# EAGLE design test-shield (EAGLE 8.3.0)
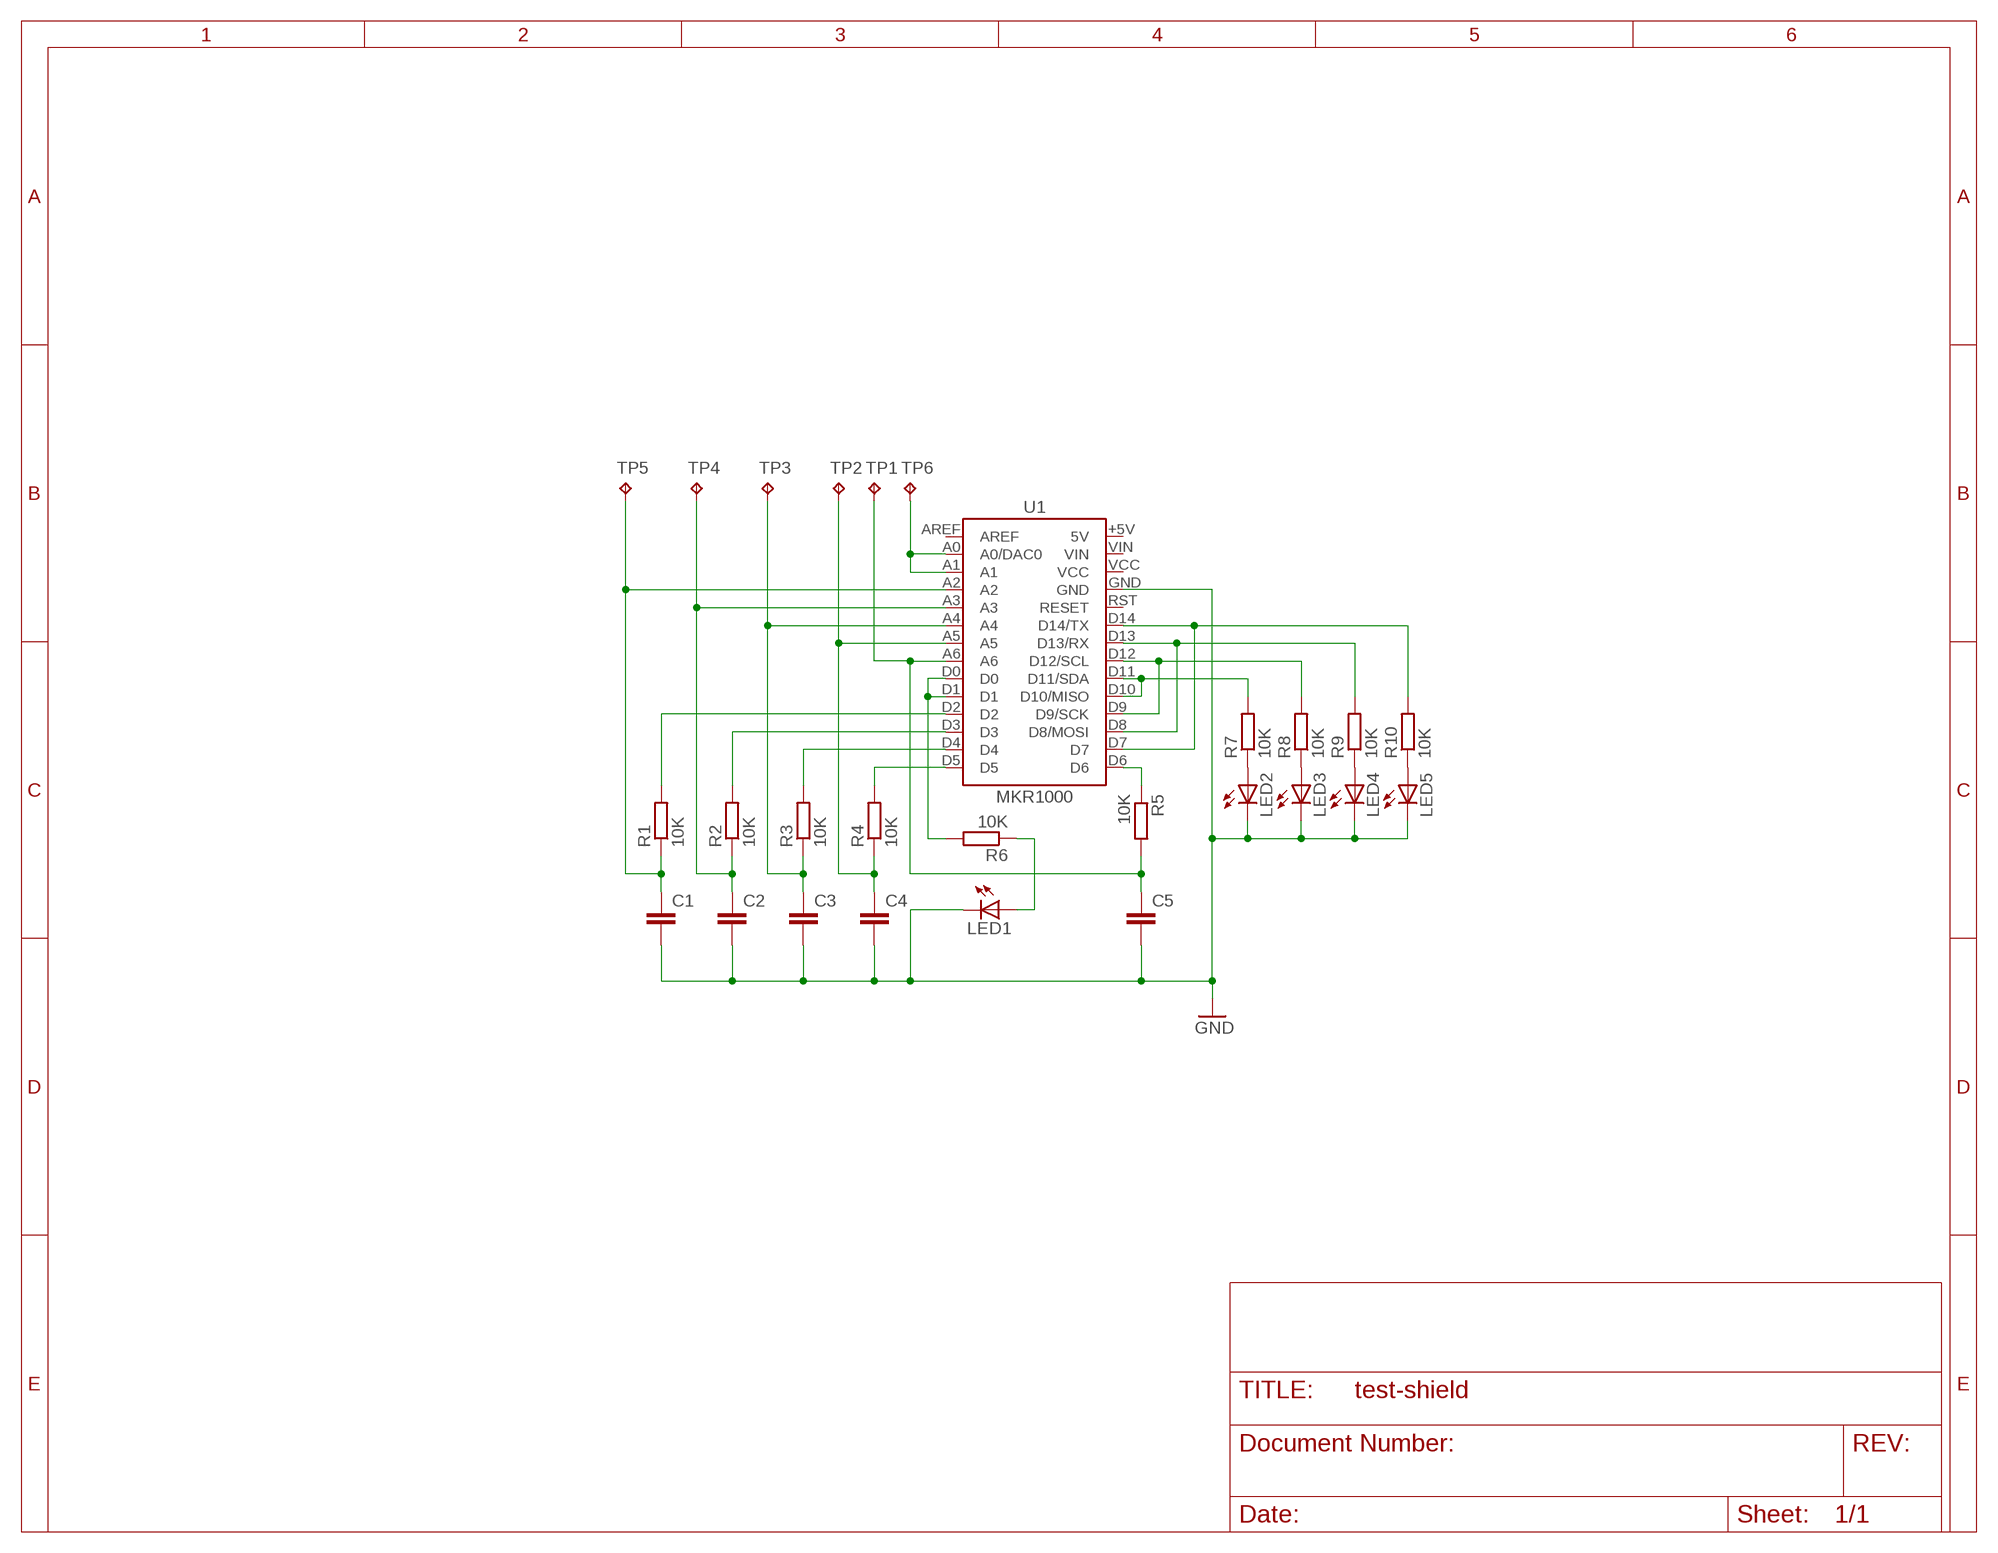
[diagram p0: schematic, sheet 1]

## Parts
C1  C-EUC0603  [C0603]
C2  C-EUC0603  [C0603]
C3  C-EUC0603  [C0603]
C4  C-EUC0603  [C0603]
C5  C-EUC0603  [C0603]
LED1  LEDCHIPLED_0805  [CHIPLED_0805]
LED2  LEDCHIPLED_0805  [CHIPLED_0805]
LED3  LEDCHIPLED_0805  [CHIPLED_0805]
LED4  LEDCHIPLED_0805  [CHIPLED_0805]
LED5  LEDCHIPLED_0805  [CHIPLED_0805]
R1  10K  R-EU_R0603  [R0603]
R2  10K  R-EU_R0603  [R0603]
R3  10K  R-EU_R0603  [R0603]
R4  10K  R-EU_R0603  [R0603]
R5  10K  R-EU_R0603  [R0603]
R6  10K  R-EU_R0603  [R0603]
R7  10K  R-EU_R0603  [R0603]
R8  10K  R-EU_R0603  [R0603]
R9  10K  R-EU_R0603  [R0603]
R10  10K  R-EU_R0603  [R0603]
TP1  TPPAD1-13  [P1-13]
TP2  TPPAD1-13  [P1-13]
TP3  TPPAD1-13  [P1-13]
TP4  TPPAD1-13  [P1-13]
TP5  TPPAD1-13  [P1-13]
TP6  TPPAD1-13  [P1-13]
U1  MKR1000  [MKR1000-THRU-HOLE]

## Nets
GND: C1.2 C2.2 C3.2 C4.2 C5.2 LED1.C LED2.C LED3.C LED4.C LED5.C U1.GND
N$1: R1.2 U1.D2
N$2: R2.2 U1.D3
N$3: R3.2 U1.D4
N$4: R4.2 U1.D5
N$6: R5.1 U1.D6
N$7: C1.1 R1.1 TP5.TP U1.A2
N$8: C2.1 R2.1 TP4.TP U1.A3
N$9: C3.1 R3.1 TP3.TP U1.A4
N$10: C4.1 R4.1 TP2.TP U1.A5
N$11: R10.2 U1.D7 U1.D14(D14/TX)
N$12: C5.1 R5.2 TP1.TP U1.A6
N$13: TP6.TP U1.A0(A0/DAC0) U1.A1
N$14: R6.2 U1.D0 U1.D1
N$15: R9.2 U1.D8(D8/MOSI) U1.D13(D13/RX)
N$16: R8.2 U1.D9(D9/SCK) U1.D12(D12/SCL)
N$17: R7.2 U1.D10(D10/MISO) U1.D11(D11/SDA)
N$18: LED2.A R7.1
N$19: LED3.A R8.1
N$20: LED4.A R9.1
N$21: LED5.A R10.1
N$22: LED1.A R6.1
Unconnected: U1.+5V(5V) U1.AREF U1.RST(RESET) U1.VCC U1.VIN

## Library data of the parts
C1-C5 = resistor:C-EU: CAPACITOR, European symbol
LED1-LED5 = adafruit:LED: LED OSRAM: - CHIPLED LG R971, LG N971, LY N971, LG Q971, LY Q971, LO R971, LY R971 LH N974, LH R974 LS Q976, LO Q976, LY Q976 LO Q996 - Hyper CHIPLED LW Q18S LB Q993, LB Q99A, LB R99A - SideLED LS A670, LO A670, LY A670, LG A670, LP A670 LB A673, LV A673, LT A673, LW A673 LH A674 LY A675 LS A676, LA A676, LO A676, LY A676, LW A676 LS A679, LY A679, LG A679 - Hyper Micro SIDELED® LS Y876, LA Y876, LO Y876, LY Y876 LT Y87S - SmartLED LW L88C, LW L88S LB L89C, LB L89S, LG L890 LS L89K, LO L89K, LY L89K LS L896, LA L896, LO L896, LY L896 - TOPLED LS T670, LO T670, LY T670, LG T670, LP T670 LSG T670, LSP T670, LSY T670, LOP T670, LYG T670 LG T671, LOG T671, LSG T671 LB T673, LV T673, LT T673, LW T673 LH T674 LS T676, LA T676, LO T676, LY T676, LB T676, LH T676, LSB T676, LW T676 LB T67C, LV T67C, LT T67C, LS T67K, LO T67K, LY T67K, LW E67C LS E67B, LA E67B, LO E67B, LY E67B, LB E67C, LV E67C, LT E67C LW T67C LS T679, LY T679, LG T679 LS T770, LO T770, LY T770, LG T770, LP T770 LB T773, LV T773, LT T773, LW T773 LH T774 LS E675, LA E675, LY E675, LS T675 LS T776, LA T776, LO T776, LY T776, LB T776 LHGB T686 LT T68C, LB T68C - Hyper Mini TOPLED® LB M676 - Mini TOPLED Santana® LG M470 LS M47K, LO M47K, LY M47K Source: http://www.osram.convergy.de/
R1-R10 = resistor:R-EU_: RESISTOR, European symbol
TP1-TP6 = testpad:TP: Test pad
U1 = arduino-shields:MKR

## Board
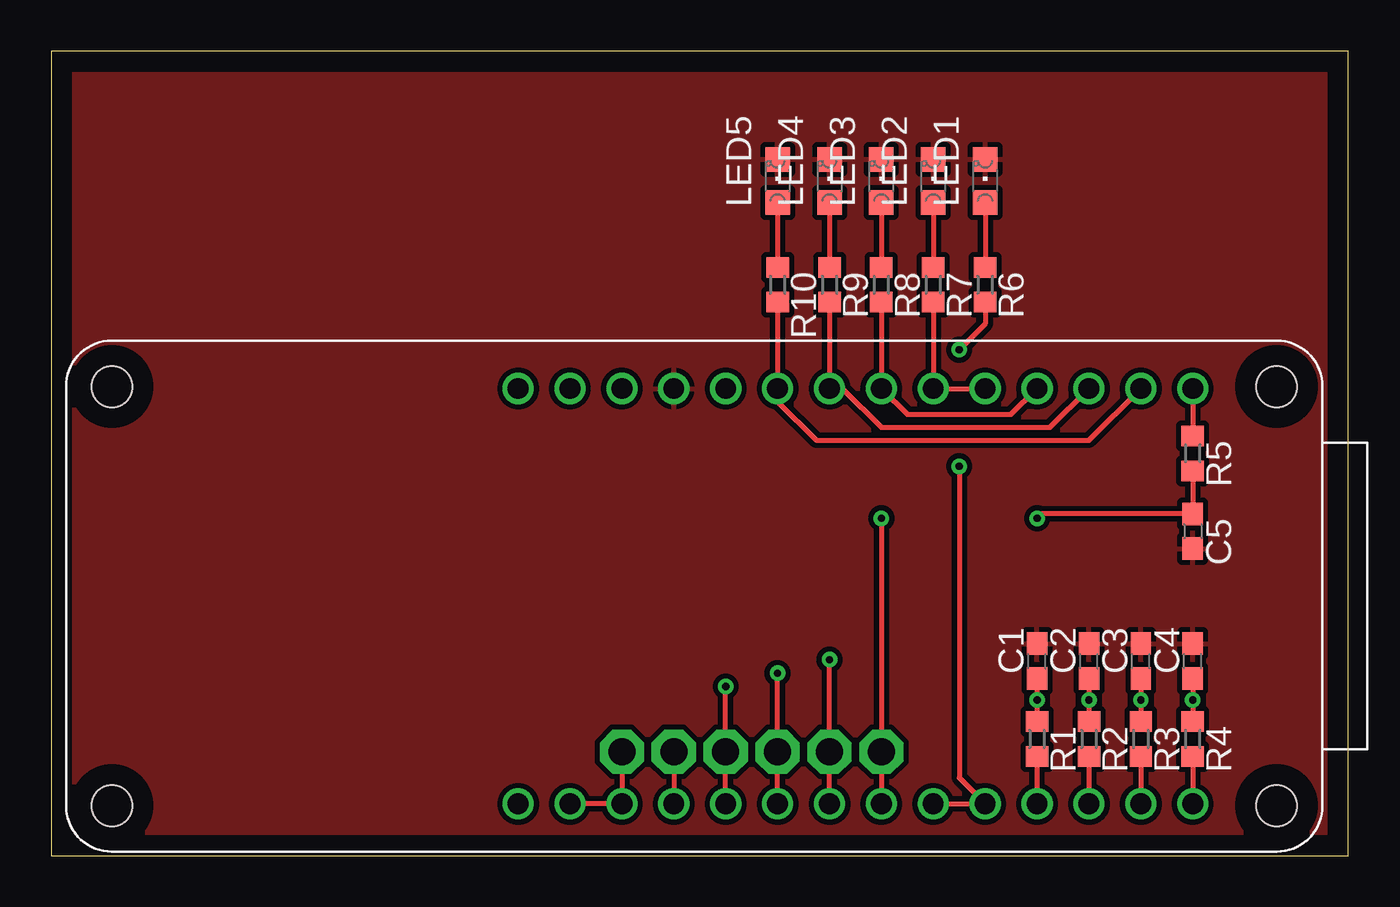
[diagram p1: board, top side]
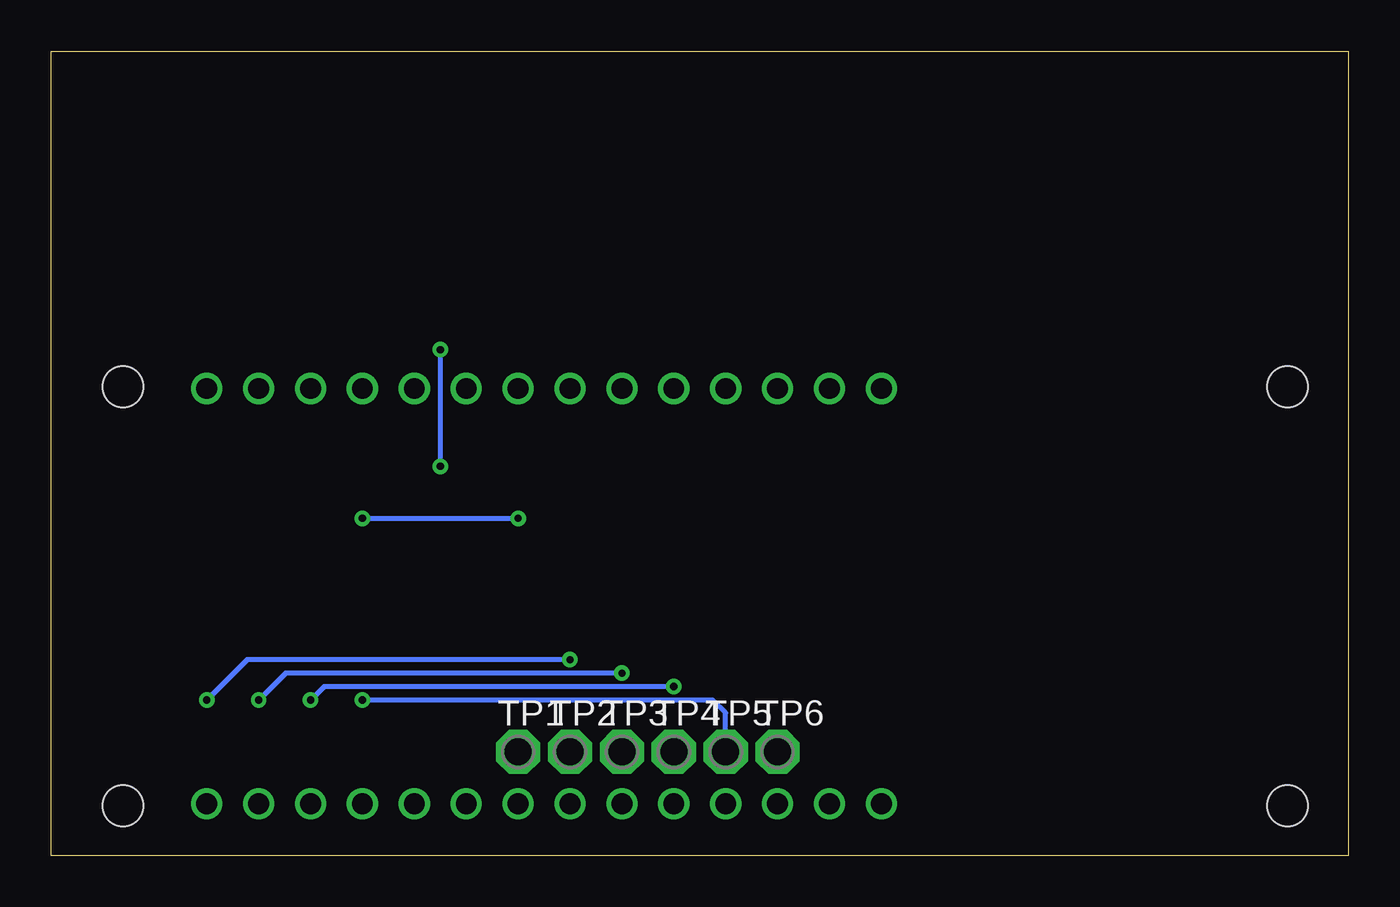
[diagram p2: board, bottom side, seen from below]

Size 63.5 x 39.37 mm. Coordinates in mm from the lower left corner, seen from the top.
Outline: 0,0 63.5,0 63.5,39.37 0,39.37 0,0
Copper layers (1*16): Top 0.035mm / dielectric 1.5mm / Bottom 0.035mm
Design rules "default": minimum track width 6mil, minimum drill 0.35mm, track to track 6mil, track to pad 6mil, pad to pad 6mil, via to via 6mil, smd to smd 6mil, copper to edge 40mil, drill to drill 6mil, minimum pad ring 10mil, minimum via ring 8mil, stop-mask expansion 4mil, vias tented up to drill 0mil, thermal gap 10mil

### Footprints (pad centres in the part's own frame; a part is rotated, then mirrored left to right if it is on the bottom)
C0603 = smd 1.1 x 1: 1 -0.85,0; 2 0.85,0
CHIPLED_0805 = smd 1.2 x 1.2: A 0,-1.05; C 0,1.05
R0603 = smd 1 x 1.1: 1 -0.85,0; 2 0.85,0
P1-13 = drill 1.321 pad 2.159 octagon: TP 0,0
MKR1000-THRU-HOLE = drill 1.016: +5V 39.37,-10.16; A0 36.83,10.16; A1 34.29,10.16; A2 31.75,10.16; A3 29.21,10.16; A4 26.67,10.16; A5 24.13,10.16; A6 21.59,10.16; AREF 39.37,10.16; D0 19.05,10.16; D1 16.51,10.16; D2 13.97,10.16; D3 11.43,10.16; D4 8.89,10.16; D5 6.35,10.16; D6 6.35,-10.16; D7 8.89,-10.16; D8 11.43,-10.16; D9 13.97,-10.16; D10 16.51,-10.16; D11 19.05,-10.16; D12 21.59,-10.16; D13 24.13,-10.16; D14 26.67,-10.16; GND 31.75,-10.16; RST 29.21,-10.16; VCC 34.29,-10.16; VIN 36.83,-10.16 | hole 2: 2.25,10.25; 2.25,-10.25; 59.25,-10.25; 59.25,10.25

### Placement (x,y rotation side)
C1  48.26,9.53 90 top
C2  50.8,9.53 90 top
C3  53.34,9.53 90 top
C4  55.88,9.53 90 top
C5  55.88,15.88 270 top
LED1  45.72,33.02 0 top
LED2  43.18,33.02 0 top
LED3  40.64,33.02 0 top
LED4  38.1,33.02 0 top
LED5  35.56,33.02 0 top
R1  48.26,5.71 270 top
R2  50.8,5.71 270 top
R3  53.34,5.71 270 top
R4  55.88,5.71 270 top
R5  55.88,19.68 270 top
R6  45.72,27.94 270 top
R7  43.18,27.94 270 top
R8  40.64,27.94 270 top
R9  38.1,27.94 270 top
R10  35.56,27.94 270 top
TP1  40.64,5.08 0 bottom
TP2  38.1,5.08 0 bottom
TP3  35.56,5.08 0 bottom
TP4  33.02,5.08 0 bottom
TP5  30.48,5.08 0 bottom
TP6  27.94,5.08 0 bottom
U1  62.23,12.7 180 top

### Tracks (layer width: path | path; a pad name or v marks a point on that pad's centre or on a via)
GND
  pour Top (isolate 0.254): 0,-1.27 64.77,-1.27 64.77,40.64 -1.27,40.64 -1.27,-1.27
N$1
  Top 0.254: R1.2 U1.D2
N$2
  Top 0.254: R2.2 U1.D3
N$3
  Top 0.254: R3.2 U1.D4
N$4
  Top 0.254: R4.2 U1.D5
N$6
  Top 0.254: U1.D6 R5.1
N$7  (via drill 0.35)
  Top 0.254: TP5.TP U1.A2 | R1.1 v48.26,7.62 C1.1
  Bottom 0.254: TP5.TP 30.48,6.99 31.11,7.62 v48.26,7.62
N$8  (via drill 0.35)
  Top 0.254: U1.A3 TP4.TP v33.02,8.28 | R2.1 v50.8,7.62 C2.1
  Bottom 0.254: v33.02,8.28 50.14,8.28 v50.8,7.62
N$9  (via drill 0.35)
  Top 0.254: U1.A4 TP3.TP v35.56,8.94 | R3.1 v53.34,7.62 C3.1
  Bottom 0.254: v35.56,8.94 52.02,8.94 v53.34,7.62
N$10  (via drill 0.35)
  Top 0.254: U1.A5 TP2.TP v38.1,9.59 | R4.1 v55.88,7.62 C4.1
  Bottom 0.254: v38.1,9.59 53.91,9.59 v55.88,7.62
N$11
  Top 0.254: R10.2 U1.D14 35.56,22.23 37.47,20.32 50.8,20.32 U1.D7
N$12  (via drill 0.35)
  Top 0.254: R5.2 C5.1 48.48,16.73 v48.26,16.51 | U1.A6 TP1.TP v40.64,16.51
  Bottom 0.254: v48.26,16.51 v40.64,16.51
N$13
  Top 0.254: 27.91,2.54 U1.A0 | 27.91,2.54 U1.A1 | TP6.TP 27.94,2.57 27.91,2.54
N$14  (via drill 0.35)
  Top 0.254: R6.2 45.72,26.04 v44.45,24.77 | v44.45,19.05 44.45,3.81 U1.D1 U1.D0
  Bottom 0.254: v44.45,24.77 v44.45,19.05
N$15
  Top 0.254: R9.2 U1.D13 38.73,22.86 40.64,20.95 48.9,20.95 U1.D8
N$16
  Top 0.254: R8.2 U1.D12 41.91,21.59 46.99,21.59 U1.D9
N$17
  Top 0.254: R7.2 U1.D11 U1.D10
N$18
  Top 0.254: LED2.A R7.1
N$19
  Top 0.254: LED3.A R8.1
N$20
  Top 0.254: LED4.A R9.1
N$21
  Top 0.254: LED5.A R10.1
N$22
  Top 0.254: LED1.A R6.1